# Altium project alva-pcb.PrjPcb
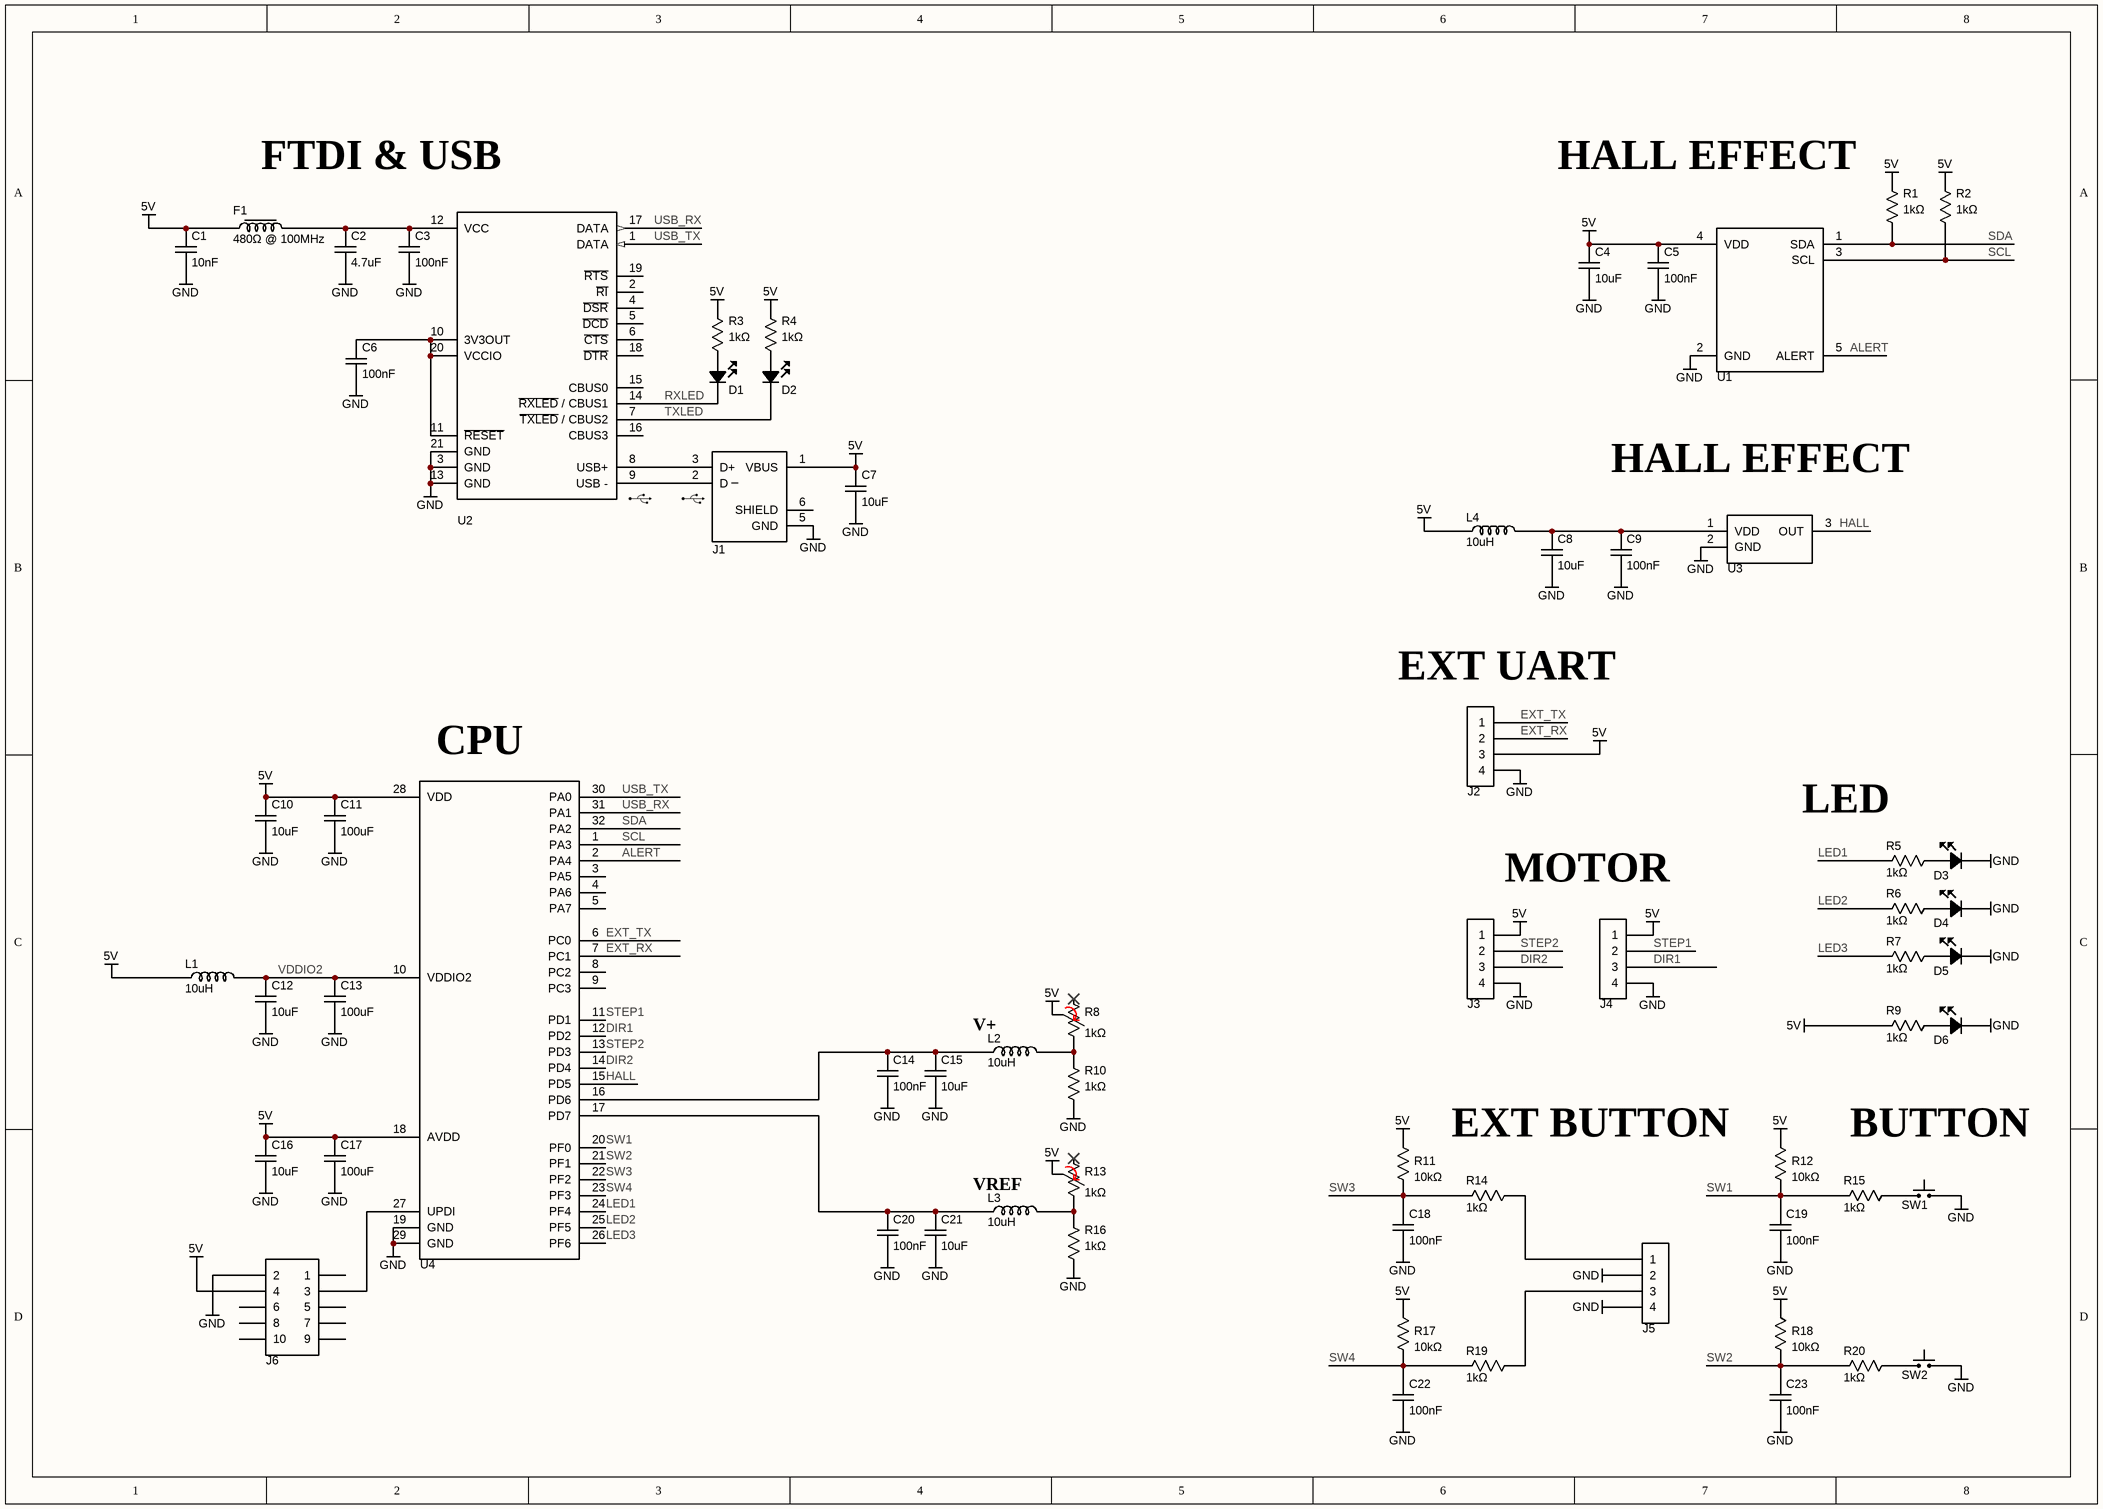
[diagram p0: schematic.SchDoc]
1 sheet, 66 parts. Net scope: global (net labels, ports and power ports of the same name join across sheets).
Board file: pcb.PcbDoc

## Sheet schematic.SchDoc
size A3; SheetNumber: 1; SheetTotal: 1

### Parts
C1  value 10nF  [capacitor 0603]  (hidden comment: passive_5)
C2  value 4.7uF  [capacitor 0603]  (hidden comment: passive_5)
C3  value 100nF  [capacitor 0603]  (hidden comment: passive_5)
C4  value 10uF  [capacitor 0603]  (hidden comment: passive_5)
C5  value 100nF  [capacitor 0603]  (hidden comment: passive_5)
C6  value 100nF  [capacitor 0603]  (hidden comment: passive_5)
C7  value 10uF  [capacitor 0603]  (hidden comment: passive_5)
C8  value 10uF  [capacitor 0603]  (hidden comment: passive_5)
C9  value 100nF  [capacitor 0603]  (hidden comment: passive_5)
C10  value 10uF  [capacitor 0603]  (hidden comment: passive_5)
C11  value 100uF  [capacitor 0603]  (hidden comment: passive_5)
C12  value 10uF  [capacitor 0603]  (hidden comment: passive_5)
C13  value 100uF  [capacitor 0603]  (hidden comment: passive_5)
C14  value 100nF  [capacitor 0603]  (hidden comment: passive_5)
C15  value 10uF  [capacitor 0603]  (hidden comment: passive_5)
C16  value 10uF  [capacitor 0603]  (hidden comment: passive_5)
C17  value 100uF  [capacitor 0603]  (hidden comment: passive_5)
C18  value 100nF  [capacitor 0603]  (hidden comment: passive_5)
C19  value 100nF  [capacitor 0603]  (hidden comment: passive_5)
C20  value 100nF  [capacitor 0603]  (hidden comment: passive_5)
C21  value 10uF  [capacitor 0603]  (hidden comment: passive_5)
C22  value 100nF  [capacitor 0603]  (hidden comment: passive_5)
C23  value 100nF  [capacitor 0603]  (hidden comment: passive_5)
D1  LED Red  [LED 0603 red]  (value not drawn)
D2  LED Red  [LED 0603 red]  (value not drawn)
D3  LED Red  [LED 0603 red]  (value not drawn)
D4  LED Red  [LED 0603 red]  (value not drawn)
D5  LED Red  [LED 0603 red]  (value not drawn)
D6  LED Red  [LED 0603 red]  (value not drawn)
F1  value 480Ω @ 100MHz  [ferrit bead 0603]  (hidden comment: passive_8)
J1  USB micro B  [USB mico B female]  (value not drawn)
J2  Header 2.54mm  [TB001-500-04BE]  (value not drawn)
J3  Header 2.54mm  [TB001-500-04BE]  (value not drawn)
J4  Header 2.54mm  [TB001-500-04BE]  (value not drawn)
J5  Header 2.54mm  [TB001-500-04BE]  (value not drawn)
J6  Header 1.27mm  [header male 2x5, pitch 1.27mm]  (value not drawn)
L1  value 10uH  [inductor 0603]  (hidden comment: passive_9)
L2  value 10uH  [inductor 0603]  (hidden comment: passive_9)
L3  value 10uH  [inductor 0603]  (hidden comment: passive_9)
L4  value 10uH  [inductor 0603]  (hidden comment: passive_9)
R1  value 1kΩ  [resistor 0603]  (hidden comment: passive_2)
R2  value 1kΩ  [resistor 0603]  (hidden comment: passive_2)
R3  value 1kΩ  [resistor 0603]  (hidden comment: passive_2)
R4  value 1kΩ  [resistor 0603]  (hidden comment: passive_2)
R5  value 1kΩ  [resistor 0603]  (hidden comment: passive_2)
R6  value 1kΩ  [resistor 0603]  (hidden comment: passive_2)
R7  value 1kΩ  [resistor 0603]  (hidden comment: passive_2)
R8  value 1kΩ  [POT]  (hidden comment: passive_13)
R9  value 1kΩ  [resistor 0603]  (hidden comment: passive_2)
R10  value 1kΩ  [resistor 0603]  (hidden comment: passive_2)
R11  value 10kΩ  [resistor 0603]  (hidden comment: passive_2)
R12  value 10kΩ  [resistor 0603]  (hidden comment: passive_2)
R13  value 1kΩ  [POT]  (hidden comment: passive_13)
R14  value 1kΩ  [resistor 0603]  (hidden comment: passive_2)
R15  value 1kΩ  [resistor 0603]  (hidden comment: passive_2)
R16  value 1kΩ  [resistor 0603]  (hidden comment: passive_2)
R17  value 10kΩ  [resistor 0603]  (hidden comment: passive_2)
R18  value 10kΩ  [resistor 0603]  (hidden comment: passive_2)
R19  value 1kΩ  [resistor 0603]  (hidden comment: passive_2)
R20  value 1kΩ  [resistor 0603]  (hidden comment: passive_2)
SW1  sensor_3  [KMR621NG LFS]  (value not drawn)
SW2  sensor_3  [KMR621NG LFS]  (value not drawn)
U1  ic_14  [SI7210-B-00-IVR]  (value not drawn)
U2  FTDI  [FT231XQ-R]  (value not drawn)
U3  ic_15  [SS495A1]  (value not drawn)
U4  cpu_7  [AVRxxDB32]  (value not drawn)

### Nets
5V: C1.2 C4.2 C5.2 C7.2 C10.2 C11.2 C16.2 C17.2 F1.1 J1.1(VBUS) J2.3 J3.1 J4.1 J6.4 L1.1 L4.1 R1.2 R2.2 R3.2 R4.2 R8.2 R9.2 R11.1 R12.1 R13.2 R17.1 R18.1 U1.4(VDD) U4.18(AVDD) U4.28(VDD)
GND: C1.1 C2.1 C3.1 C4.1 C5.1 C6.1 C7.1 C8.1 C9.1 C10.1 C11.1 C12.1 C13.1 C14.1 C15.1 C16.1 C17.1 C18.1 C19.1 C20.1 C21.1 C22.1 C23.1 D3.2 D4.2 D5.2 D6.2 J1.5(GND) J2.4 J3.4 J4.4 J5.2 J5.4 J6.2 R10.1 R16.1 SW1.2 SW2.2 U1.2(GND) U2.3(GND) U2.13(GND) U2.21(GND) U3.2(GND) U4.19(GND) U4.29(GND)
ALERT: U1.5(ALERT) U4.2(PA4)
DIR1: J4.3 U4.12(PD2)
DIR2: J3.3 U4.14(PD4)
EXT_RX: J2.2 U4.7(PC1)
EXT_TX: J2.1 U4.6(PC0)
HALL: U3.3(OUT) U4.15(PD5)
LED1: R5.2 U4.24(PF4)
LED2: R6.2 U4.25(PF5)
LED3: R7.2 U4.26(PF6)
RXLED: D1.2 U2.14(~{RXLED}_/_CBUS1)
SCL: R2.1 U1.3(SCL) U4.1(PA3)
SDA: R1.1 U1.1(SDA) U4.32(PA2)
STEP1: J4.2 U4.11(PD1)
STEP2: J3.2 U4.13(PD3)
SW1: C19.2 R12.2 R15.2 U4.20(PF0)
SW2: C23.2 R18.2 R20.2 U4.21(PF1)
SW3: C18.2 R11.2 R14.2 U4.22(PF2)
SW4: C22.2 R17.2 R19.2 U4.23(PF3)
TXLED: D2.2 U2.7(~{TXLED}_/_CBUS2)
USB_RX: U2.17(DATA) U4.31(PA1)
USB_TX: U2.1(DATA) U4.30(PA0)
VDDIO2: C12.2 C13.2 L1.2 U4.10(VDDIO2)
NetC2_2: C2.2 C3.2 F1.2 U2.12(VCC)
NetC6_2: C6.2 U2.10(3V3OUT) U2.11(~{RESET}) U2.20(VCCIO)
NetC8_2: C8.2 C9.2 L4.2 U3.1(VDD)
NetC14_2: C14.2 C15.2 L2.2 U4.16(PD6)
NetC20_2: C20.2 C21.2 L3.2 U4.17(PD7)
NetD1_1: D1.1 R3.1
NetD2_1: D2.1 R4.1
NetD3_1: D3.1 R5.1
NetD4_1: D4.1 R6.1
NetD5_1: D5.1 R7.1
NetD6_1: D6.1 R9.1
NetJ1_2: J1.2(D) U2.9(USB_-)
NetJ1_3: J1.3(D+) U2.8(USB+)
NetJ5_1: J5.1 R14.1
NetJ5_3: J5.3 R19.1
NetJ6_3: J6.3 U4.27(UPDI)
NetL2_1: L2.1 R8.3 R10.2
NetL3_1: L3.1 R13.3 R16.2
NetR15_1: R15.1 SW1.1
NetR20_1: R20.1 SW2.1

Not connected (* = marked no-connect by the designer): J1 6(SHIELD); J6 1 5 6 7 8 9 10; R8 1*; R13 1*; U2 2(~{RI}) 4(~{DSR}) 5(~{DCD}) 6(~{CTS}) 15(CBUS0) 16(CBUS3) 18(~{DTR}) 19(~{RTS}); U4 3(PA5) 4(PA6) 5(PA7) 8(PC2) 9(PC3)

### Notes on the sheet
- FTDI & USB
- HALL EFFECT
- (near J2) EXT UART
- (near U4) CPU
- (near R5) LED
- MOTOR
- (near L2) V+
- (near L3) VREF
- EXT BUTTON
- BUTTON
- (in symbol connector_34) _

### Library data of the parts
C1-C23 = passive_5: Capacitor 0603
D1-D6 = diode_0: LED 0603 red
F1 = passive_8: Ferrite bead 0603
J1 = connector_34: USB micro B (2.0); Manufacturer 1: Amphenol ICC (FCI); Manufacturer Part Number 1: 10118194-0001LF; Supplier 1: Digi-Key; Supplier Part Number 1: 609-4618-1-ND; Link: https://www.digikey.no/product-detail/en/amphenol-icc-fci/10118194-0001LF/609-4618-1-ND/2785382
J2-J5 = connector_53: Screw Terminal
J6 = connector_17: Header male 2x5, pitch 1.27mm
L1-L4 = passive_9: Inductor 0603
R1-R7 R9-R12 R14-R20 = passive_2: Resistor 0603
R8 R13 = passive_13: Potmeter
SW1 SW2 = sensor_3: Tactile switch SMD, tiny; Manufacturer 1: C&K; Supplier 1: Digi-Key; Supplier Part Number 1: CKN10684CT-ND; Manufacturer Part Number 1: KMR621NG LFS; Link: https://www.digikey.no/product-detail/en/c-k/KMR621NG-LFS/CKN10684CT-ND/6035356
U1 = ic_14: Hall-effect; Supplier Part Number 1: SI7210-B-00-IVR
U2 = ic_1: USB to UART converter, FTDI, single, 20 pins, QFN; Manufacturer 1: FTDI, Future Technology Devices International Ltd; Supplier 1: Digi-Key; Supplier Part Number 1: 768-1128-1-ND; Manufacturer Part Number 1: FT231XQ-R
U3 = ic_15: SS495A1
U4 = cpu_7: AVRxxDB32